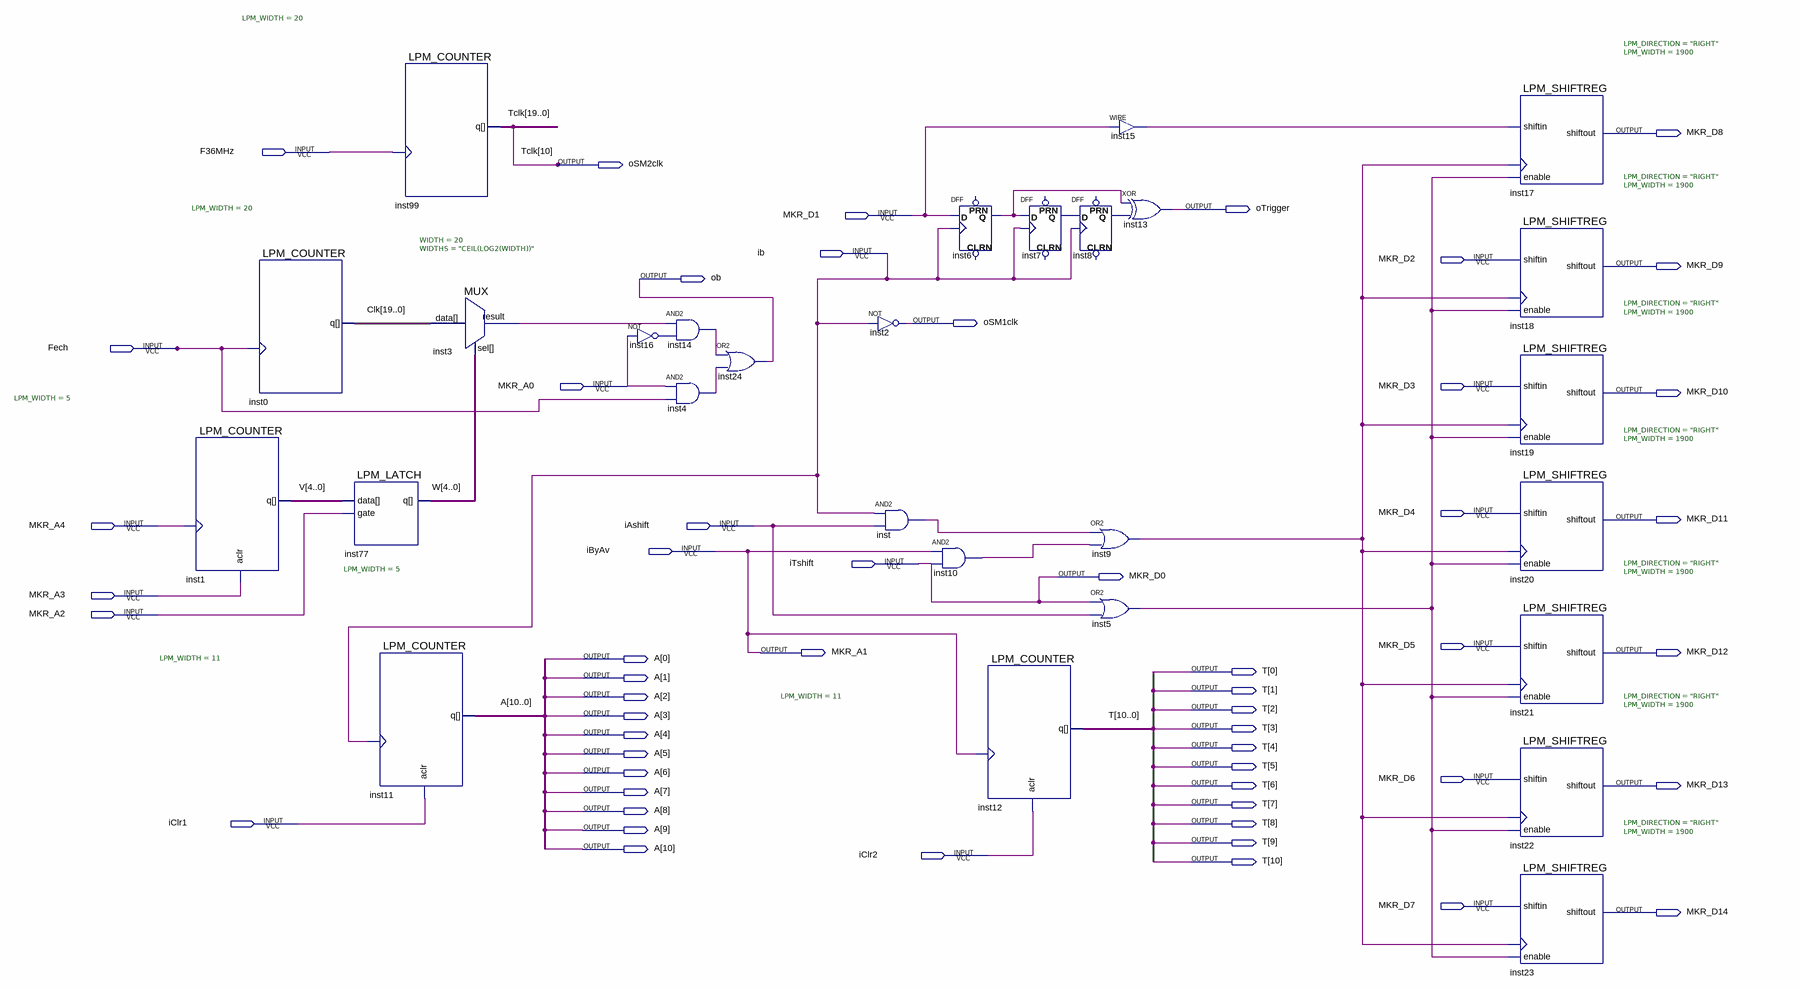
[diagram p0: schematic sheet]
// Quartus schematic Schema.bdf as structural Verilog: 28 symbols, 54 pins
module Schema (
  input  F36MHz,
  input  MKR_D1,
  input  ib,
  input  MKR_D2,
  input  Fech,
  input  MKR_A0,
  input  MKR_D3,
  input  MKR_D4,
  input  MKR_A4,
  input  iAshift,
  input  iByAv,
  input  iTshift,
  input  MKR_A3,
  input  MKR_A2,
  input  MKR_D5,
  input  MKR_D6,
  input  iClr1,
  input  iClr2,
  input  MKR_D7,
  output MKR_D8,
  output oSM2clk,
  output oTrigger,
  output MKR_D9,
  output ob,
  output oSM1clk,
  output MKR_D10,
  output MKR_D11,
  output MKR_D0,
  output MKR_A1,
  output MKR_D12,
  output [10:0] A,
  output [10:0] T,
  output MKR_D13,
  output MKR_D14
);

  wire inst3_result, inst4_out, inst5_out, inst6_q, inst7_q, inst8_q, inst9_out, inst10_out, inst14_out,
       inst15_out, inst16_out, inst_out;
  wire [4:0] V, W;
  wire [19:0] Clk, Tclk;

  LPM_COUNTER #(.LPM_WIDTH(5)) inst1 (.aclr(MKR_A3), .clock(MKR_A4), .q(V));
  LPM_COUNTER #(.LPM_WIDTH(20)) inst0 (.clock(Fech), .q(Clk));
  LPM_LATCH #(.LPM_WIDTH(5)) inst77 (.data(V), .gate(MKR_A2), .q(W));
  LPM_COUNTER #(.LPM_WIDTH(11)) inst11 (.aclr(iClr1), .clock(ib), .q(A));
  LPM_COUNTER #(.LPM_WIDTH(20)) inst99 (.clock(F36MHz), .q({Tclk[19:11], oSM2clk, Tclk[9:0]}));
  MUX #(.WIDTH(20), .WIDTHS("CEIL(LOG2(WIDTH))")) inst3 (.data(Clk), .sel(W), .result(inst3_result));
  and inst14 (inst14_out, inst3_result, inst16_out);
  not inst16 (inst16_out, MKR_A0);
  and inst4 (inst4_out, MKR_A0, Fech);
  or inst24 (ob, inst14_out, inst4_out);
  not inst2 (oSM1clk, ib);
  and inst (inst_out, ib, iAshift);
  DFF inst6 (.CLK(ib), .D(MKR_D1), .Q(inst6_q));  // open: CLRN, PRN
  and inst10 (inst10_out, iByAv, iTshift);
  LPM_COUNTER #(.LPM_WIDTH(11)) inst12 (.aclr(iClr2), .clock(iByAv), .q(T));
  DFF inst7 (.CLK(ib), .D(inst6_q), .Q(inst7_q));  // open: CLRN, PRN
  DFF inst8 (.CLK(ib), .D(inst7_q), .Q(inst8_q));  // open: CLRN, PRN
  assign inst15_out = MKR_D1;  // WIRE inst15
  xor inst13 (oTrigger, inst6_q, inst8_q);
  or inst9 (inst9_out, inst_out, inst10_out);
  or inst5 (inst5_out, iTshift, iAshift);
  LPM_SHIFTREG #(.LPM_DIRECTION("RIGHT"), .LPM_WIDTH(1900)) inst17 (
    .clock(inst9_out), .enable(inst5_out), .shiftin(inst15_out), .shiftout(MKR_D8));
  LPM_SHIFTREG #(.LPM_DIRECTION("RIGHT"), .LPM_WIDTH(1900)) inst18 (
    .clock(inst9_out), .enable(inst5_out), .shiftin(MKR_D2), .shiftout(MKR_D9));
  LPM_SHIFTREG #(.LPM_DIRECTION("RIGHT"), .LPM_WIDTH(1900)) inst19 (
    .clock(inst9_out), .enable(inst5_out), .shiftin(MKR_D3), .shiftout(MKR_D10));
  LPM_SHIFTREG #(.LPM_DIRECTION("RIGHT"), .LPM_WIDTH(1900)) inst20 (
    .clock(inst9_out), .enable(inst5_out), .shiftin(MKR_D4), .shiftout(MKR_D11));
  LPM_SHIFTREG #(.LPM_DIRECTION("RIGHT"), .LPM_WIDTH(1900)) inst21 (
    .clock(inst9_out), .enable(inst5_out), .shiftin(MKR_D5), .shiftout(MKR_D12));
  LPM_SHIFTREG #(.LPM_DIRECTION("RIGHT"), .LPM_WIDTH(1900)) inst22 (
    .clock(inst9_out), .enable(inst5_out), .shiftin(MKR_D6), .shiftout(MKR_D13));
  LPM_SHIFTREG #(.LPM_DIRECTION("RIGHT"), .LPM_WIDTH(1900)) inst23 (
    .clock(inst9_out), .enable(inst5_out), .shiftin(MKR_D7), .shiftout(MKR_D14));

  assign MKR_A1 = iByAv;
  assign MKR_D0 = iTshift;

  // Other names for the same wires on the sheet: Tclk[10] = oSM2clk
endmodule
